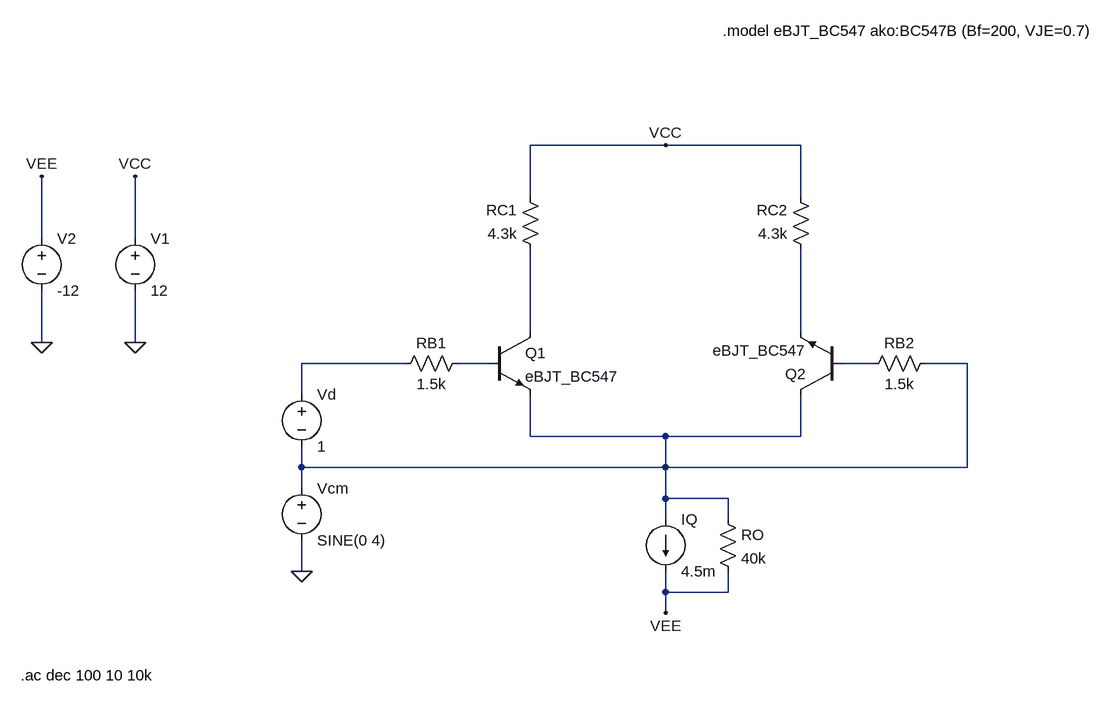
[diagram p0: schematic exp71.asc]
exp71.asc, the LTspice schematic file:
Version 4
SHEET 1 1048 680
WIRE 272 -208 64 -208
WIRE 480 -208 272 -208
WIRE 64 -128 64 -208
WIRE 480 -128 480 -208
WIRE -688 -64 -688 -160
WIRE -544 -64 -544 -160
WIRE 64 80 64 -48
WIRE 480 80 480 -48
WIRE -688 96 -688 16
WIRE -544 96 -544 16
WIRE -128 128 -288 128
WIRE 0 128 -48 128
WIRE 592 128 544 128
WIRE 736 128 672 128
WIRE -288 176 -288 128
WIRE 64 240 64 176
WIRE 272 240 64 240
WIRE 480 240 480 176
WIRE 480 240 272 240
WIRE -288 288 -288 256
WIRE 272 288 272 240
WIRE 272 288 -288 288
WIRE 736 288 736 128
WIRE 736 288 272 288
WIRE -288 320 -288 288
WIRE 272 336 272 288
WIRE 368 336 272 336
WIRE 272 368 272 336
WIRE 368 368 368 336
WIRE -288 448 -288 400
WIRE 272 480 272 448
WIRE 368 480 368 448
WIRE 368 480 272 480
WIRE 272 512 272 480
FLAG -544 96 0
FLAG -544 -160 VCC
FLAG -688 96 0
FLAG -688 -160 VEE
FLAG 272 -208 VCC
FLAG 272 512 VEE
FLAG -288 448 0
SYMBOL npn 544 176 R180
SYMATTR InstName Q2
SYMATTR Value eBJT_BC547
SYMBOL voltage -544 -80 R0
WINDOW 123 0 0 Left 0
WINDOW 39 0 0 Left 0
SYMATTR InstName V1
SYMATTR Value 12
SYMBOL npn 0 80 R0
SYMATTR InstName Q1
SYMATTR Value eBJT_BC547
SYMBOL res -32 112 R90
WINDOW 0 0 56 VBottom 2
WINDOW 3 32 56 VTop 2
SYMATTR InstName RB1
SYMATTR Value 1.5k
SYMBOL res 80 -32 R180
WINDOW 0 36 76 Left 2
WINDOW 3 36 40 Left 2
SYMATTR InstName RC1
SYMATTR Value 4.3k
SYMBOL res 496 -32 R180
WINDOW 0 36 76 Left 2
WINDOW 3 36 40 Left 2
SYMATTR InstName RC2
SYMATTR Value 4.3k
SYMBOL res 576 144 R270
WINDOW 0 32 56 VTop 2
WINDOW 3 0 56 VBottom 2
SYMATTR InstName RB2
SYMATTR Value 1.5k
SYMBOL res 352 352 R0
SYMATTR InstName RO
SYMATTR Value 40k
SYMBOL current 272 368 R0
SYMATTR InstName IQ
SYMATTR Value 4.5m
SYMBOL voltage -688 -80 R0
WINDOW 123 0 0 Left 0
WINDOW 39 0 0 Left 0
SYMATTR InstName V2
SYMATTR Value -12
SYMBOL voltage -288 160 R0
SYMATTR InstName Vd
SYMATTR Value 1
SYMBOL voltage -288 304 R0
WINDOW 123 0 0 Left 0
WINDOW 39 0 0 Left 0
SYMATTR InstName Vcm
SYMATTR Value SINE(0 4)
TEXT 360 -384 Left 2 !.model eBJT_BC547 ako:BC547B (Bf=200, VJE=0.7)
TEXT -720 608 Left 2 !.ac dec 100 10 10k

The netlist it stands for:
* exp71.asc
Q2 N006 N005 N002 0 eBJT_BC547
V1 VCC 0 12
Q1 N001 N004 N006 0 eBJT_BC547
RB1 N004 N003 1.5k
RC1 N001 VCC 4.3k
RC2 N002 VCC 4.3k
RB2 N005 N006 1.5k
RO N006 VEE 40k
IQ N006 VEE 4.5m
V2 VEE 0 -12
Vd N003 N006 1
Vcm N006 0 SINE(0 4)
.model NPN NPN
.model PNP PNP
.lib standard.bjt
.model eBJT_BC547 ako:BC547B (Bf=200, VJE=0.7)
.ac dec 100 10 10k
.backanno
.end